# EAGLE schematic core51822_pinout (EAGLE 9.3.2)
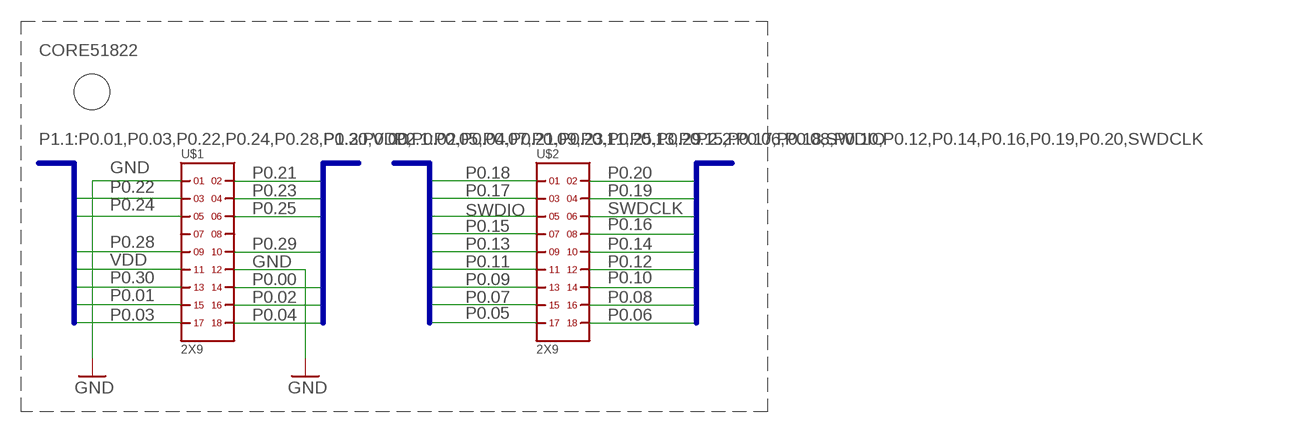
[diagram p0: schematic, sheet 1]

## Parts
U$1  2X9  [2X9]
U$2  2X9  [2X9]

## Nets
GND: U$1.1 U$1.12
P0.00: U$1.14
P0.01: U$1.15
P0.02: U$1.16
P0.03: U$1.17
P0.04: U$1.18
P0.05: U$2.17
P0.06: U$2.18
P0.07: U$2.15
P0.08: U$2.16
P0.09: U$2.13
P0.10: U$2.14
P0.11: U$2.11
P0.12: U$2.12
P0.13: U$2.9
P0.14: U$2.10
P0.15: U$2.7
P0.16: U$2.8
P0.17: U$2.3
P0.18: U$2.1
P0.19: U$2.4
P0.20: U$2.2
P0.21: U$1.2
P0.22: U$1.3
P0.23: U$1.4
P0.24: U$1.5
P0.25: U$1.6
P0.28: U$1.9
P0.29: U$1.10
P0.30: U$1.13
SWDCLK: U$2.6
SWDIO: U$2.5
VDD [Vcc]: U$1.11
Unconnected: U$1.7 U$1.8

## Buses
P1.1:P0.01,P0.03,P0.22,P0.24,P0.28,P0.30,VDD
P1.2:P0.00,P0.02,P0.04,P0.21,P0.23,P0.25,P0.29
P2.1:P0.05,P0.07,P0.09,P0.11,P0.13,P0.15,P0.17,P0.18,SWDIO
P2.2:P0.06,P0.08,P0.10,P0.12,P0.14,P0.16,P0.19,P0.20,SWDCLK

## Notes on the sheet
- CORE51822

## Library data of the parts
U$1 U$2 = headers(2mm):2X9

## Net classes
0 default: width 0.406 mm, clearance 0.254 mm
1 Vcc: width 1.016 mm, clearance 0.254 mm